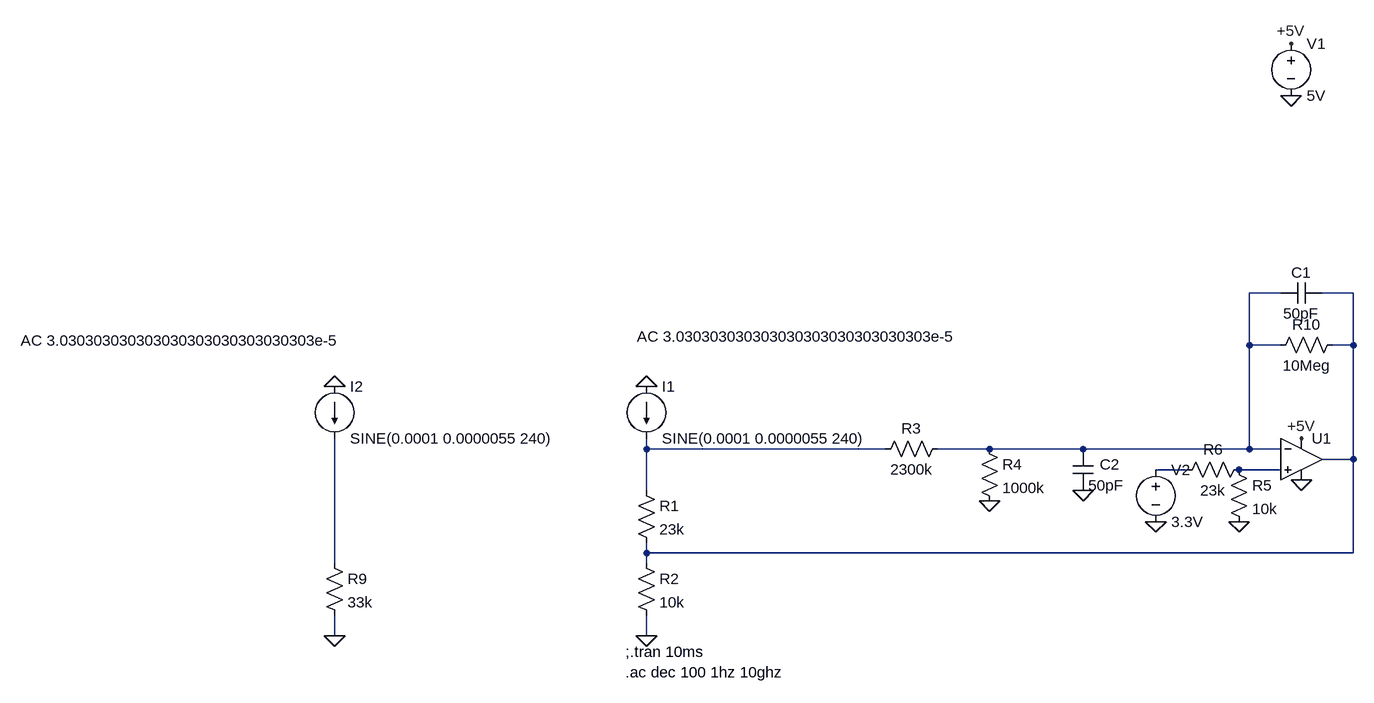
[diagram p0: schematic Trim Temp Variation.asc]
Trim Temp Variation.asc, the LTspice schematic file:
Version 4
SHEET 1 1348 1048
WIRE 640 -96 592 -96
WIRE 752 -96 704 -96
WIRE 592 -16 592 -96
WIRE 640 -16 592 -16
WIRE 752 -16 752 -96
WIRE 752 -16 720 -16
WIRE -336 144 -336 128
WIRE 32 144 -336 144
WIRE 192 144 112 144
WIRE 336 144 192 144
WIRE 592 144 592 -16
WIRE 592 144 336 144
WIRE 640 144 592 144
WIRE 752 160 752 -16
WIRE 752 160 704 160
WIRE 496 176 448 176
WIRE 640 176 576 176
WIRE -336 208 -336 144
WIRE -336 304 -336 288
WIRE 752 304 752 160
WIRE 752 304 -336 304
WIRE -816 320 -816 128
WIRE -336 320 -336 304
WIRE -816 432 -816 400
WIRE -336 432 -336 400
FLAG -336 48 0
FLAG -336 432 0
FLAG 672 192 0
FLAG 656 -400 0
FLAG 656 -480 +5V
FLAG 672 128 +5V
FLAG 448 256 0
FLAG -816 48 0
FLAG -816 432 0
FLAG 336 208 0
FLAG 192 224 0
FLAG 576 256 0
SYMBOL current -336 48 R0
WINDOW 123 -15 -77 Left 2
WINDOW 39 0 0 Left 0
SYMATTR Value2 AC 3.030303030303030303030303030303e-5
SYMATTR InstName I1
SYMATTR Value SINE(0.0001 0.0000055 240)
SYMBOL res -352 192 R0
SYMATTR InstName R1
SYMATTR Value 23k
SYMBOL res -352 304 R0
SYMATTR InstName R2
SYMATTR Value 10k
SYMBOL OpAmps\\UniversalOpAmp 672 160 R0
SYMATTR InstName U1
SYMBOL voltage 656 -496 R0
SYMATTR InstName V1
SYMATTR Value 5V
SYMBOL voltage 448 160 R0
SYMATTR InstName V2
SYMATTR Value 3.3V
SYMBOL current -816 48 R0
WINDOW 123 -483 -71 Left 2
WINDOW 39 0 0 Left 0
SYMATTR Value2 AC 3.030303030303030303030303030303e-5
SYMATTR InstName I2
SYMATTR Value SINE(0.0001 0.0000055 240)
SYMBOL res -832 304 R0
SYMATTR InstName R9
SYMATTR Value 33k
SYMBOL res 736 -32 R90
WINDOW 0 0 56 VBottom 2
WINDOW 3 32 56 VTop 2
SYMATTR InstName R10
SYMATTR Value 10Meg
SYMBOL cap 320 144 R0
WINDOW 0 42 24 Left 2
SYMATTR InstName C2
SYMATTR Value 50pF
SYMBOL res 128 128 R90
WINDOW 0 0 56 VBottom 2
WINDOW 3 32 56 VTop 2
SYMATTR InstName R3
SYMATTR Value 2300k
SYMBOL res 176 128 R0
SYMATTR InstName R4
SYMATTR Value 1000k
SYMBOL cap 704 -112 R90
WINDOW 0 0 32 VBottom 2
WINDOW 3 32 32 VTop 2
SYMATTR InstName C1
SYMATTR Value 50pF
SYMBOL res 560 160 R0
SYMATTR InstName R5
SYMATTR Value 10k
SYMBOL res 592 160 R90
WINDOW 0 0 56 VBottom 2
WINDOW 3 32 56 VTop 2
SYMATTR InstName R6
SYMATTR Value 23k
TEXT -368 456 Left 2 !;.tran 10ms
TEXT -368 488 Left 2 !.ac dec 100 1hz 10ghz

The netlist it stands for:
* Trim Temp Variation.asc
I1 0 N003 SINE(0.0001 0.0000055 240) AC 3.030303030303030303030303030303e-5
R1 N003 N002 23k
R2 N002 0 10k
XU1 N005 N001 +5V 0 N002 level1 Avol=1Meg GBW=10Meg Vos=0 En=0 Enk=0 In=0 Ink=0 Rin=500Meg  ; pins In+ In- V+ V- OUT
V1 +5V 0 5V
V2 N004 0 3.3V
I2 0 N006 SINE(0.0001 0.0000055 240) AC 3.030303030303030303030303030303e-5
R9 N006 0 33k
R10 N002 N001 10Meg
C2 N001 0 50pF
R3 N001 N003 2300k
R4 N001 0 1000k
C1 N002 N001 50pF
R5 N005 0 10k
R6 N005 N004 23k
;.tran 10ms
.ac dec 100 1hz 10ghz
.lib UniversalOpAmp1.lib
.backanno
.end